# EAGLE design MM2017-18_uC_Main (EAGLE 8.5.0)
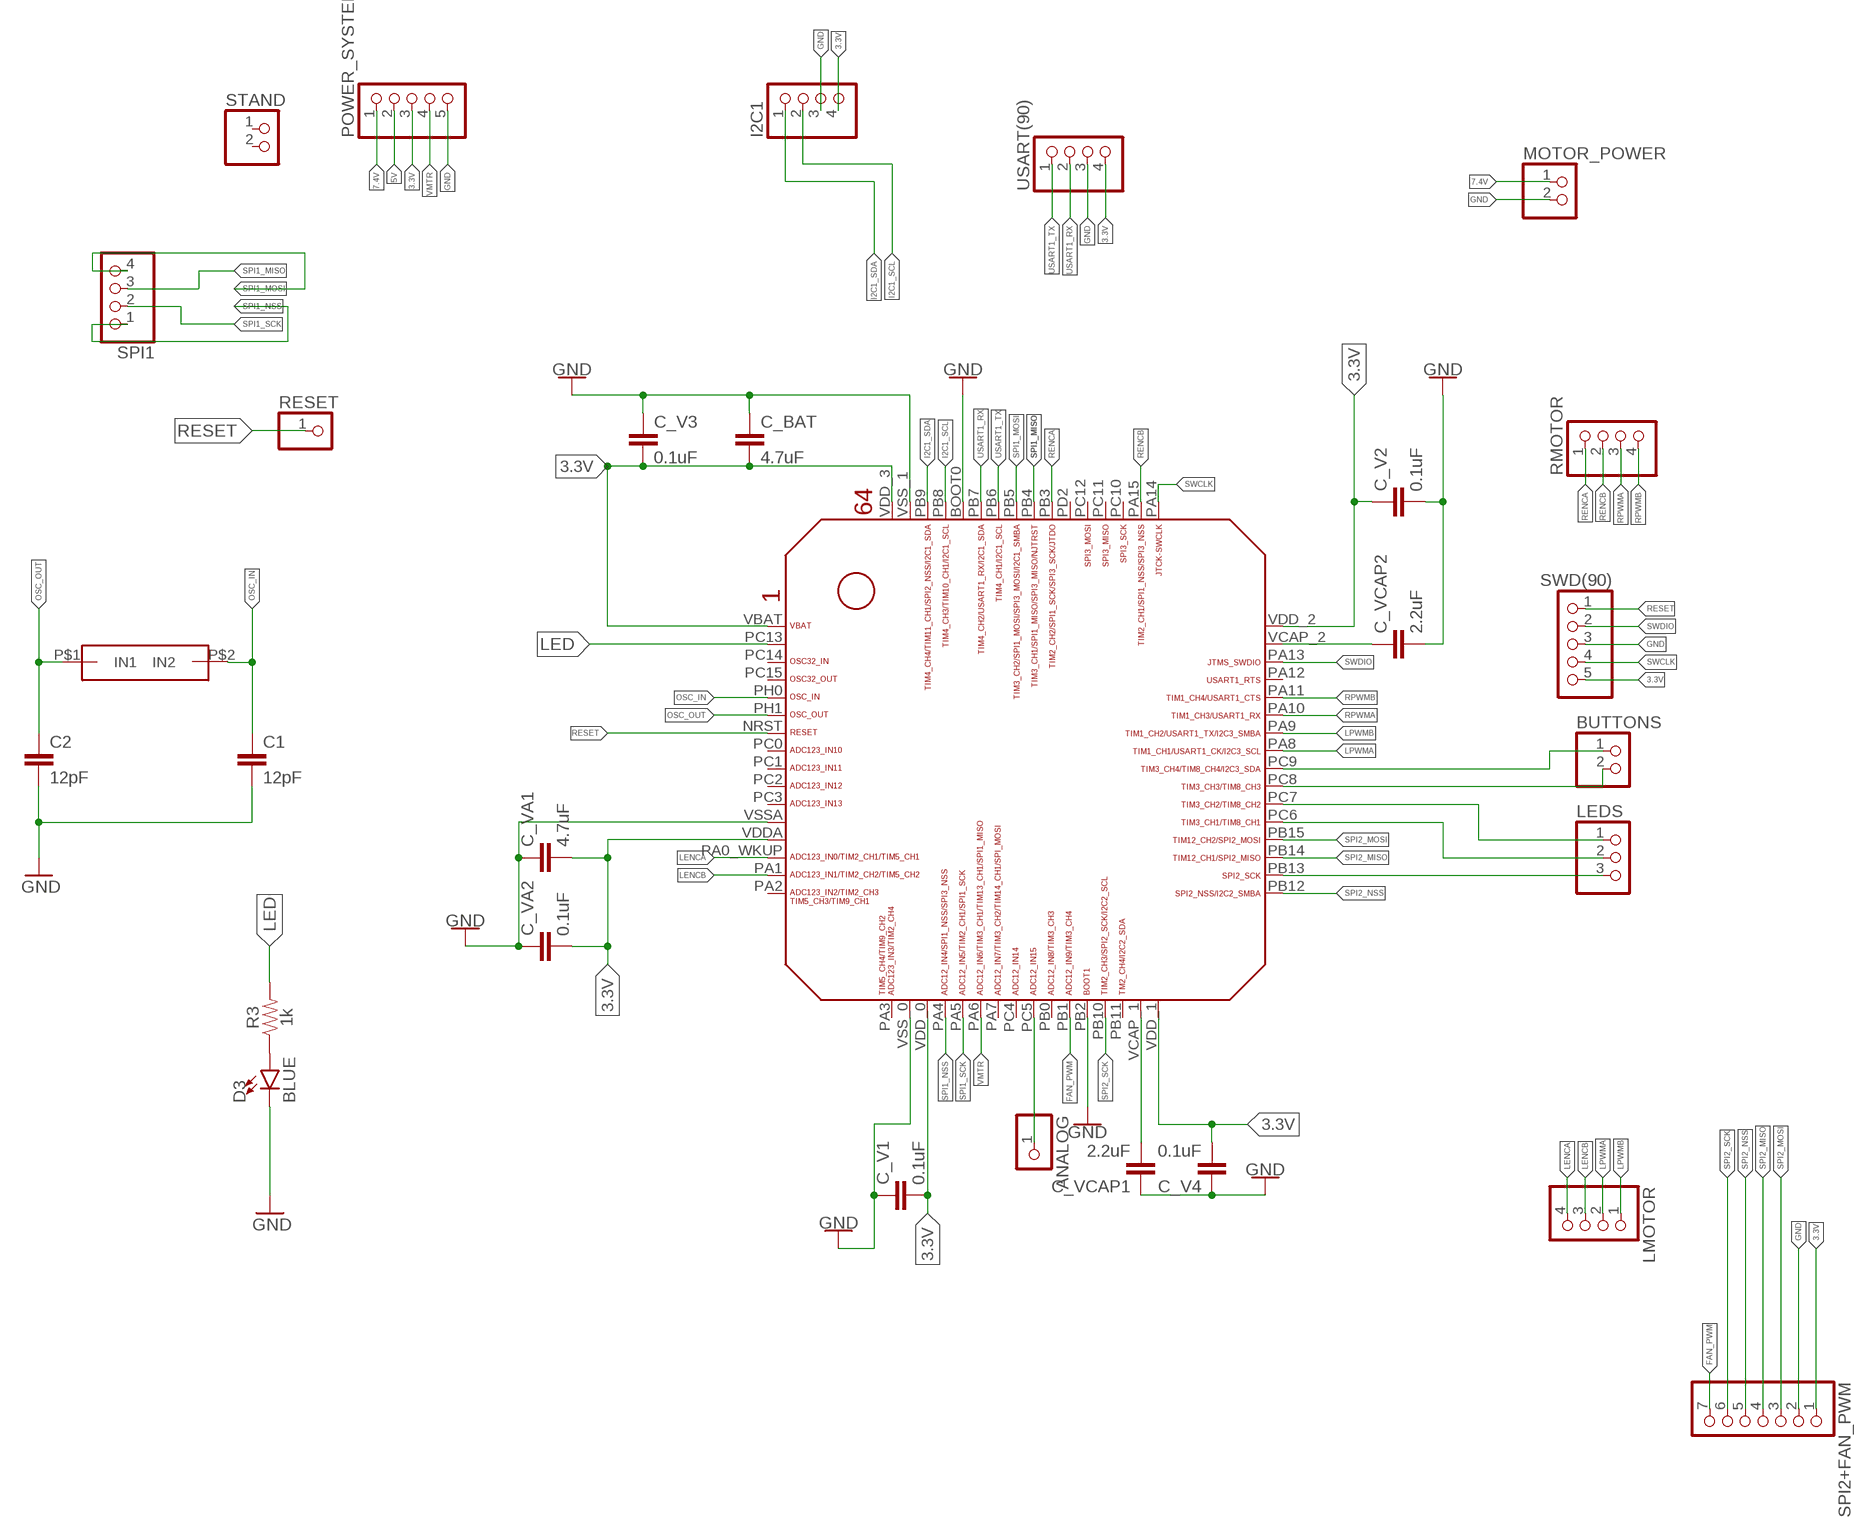
[diagram p0: schematic, sheet 1]

## Parts
ANALOG  PINHD-1X1  [1X01]
BUTTONS  PINHD-1X2  [1X02]
C1  12pF  22PF-0603-50V-5%  [0603]
C2  12pF  22PF-0603-50V-5%  [0603]
C_BAT  4.7uF  22UF-0805-6.3V-20%  [0805]
C_V1  0.1uF  22UF-0805-6.3V-20%  [0805]
C_V2  0.1uF  22UF-0805-6.3V-20%  [0805]
C_V3  0.1uF  22UF-0805-6.3V-20%  [0805]
C_V4  0.1uF  22UF-0805-6.3V-20%  [0805]
C_VA1  4.7uF  22UF-0805-6.3V-20%  [0805]
C_VA2  0.1uF  22UF-0805-6.3V-20%  [0805]
C_VCAP1  2.2uF  22UF-0805-6.3V-20%  [0805]
C_VCAP2  2.2uF  22UF-0805-6.3V-20%  [0805]
D3  BLUE  LED-BLUE1206  [LED-1206]
I2C1  PINHD-1X4  [1X04]
LEDS  PINHD-1X3  [1X03]
LMOTOR  PINHD-1X4  [1X04]
MOTOR_POWER  PINHD-1X2  [1X02]
POWER_SYSTEM  PINHD-1X5  [1X05]
R3  1k  0.75OHM-0805-1/4W-1%  [0805]
RESET  PINHD-1X1  [1X01]
RMOTOR  PINHD-1X4  [1X04]
SPI1  PINHD-1X4  [1X04]
SPI2+FAN_PWM  PINHD-1X7  [1X07]
STAND  PINHD-1X2  [1X02]
SWD(90)  PINHD-1X5  [1X05]
U$1  STM32F405/415_LQFP64  [STM32F405/415_LQFP64]
U$2  OSC  [OSC]
USART(90)  PINHD-1X4  [1X04]

## Nets
3.3V: C_BAT.2 C_V1.2 C_V2.1 C_V3.2 C_V4.2 C_VA1.2 C_VA2.2 I2C1.4 POWER_SYSTEM.3 SPI2+FAN_PWM.1 SWD(90).5 U$1.VBAT U$1.VDD_0 U$1.VDD_1 U$1.VDD_2 U$1.VDD_3 U$1.VDDA USART(90).4
5V: POWER_SYSTEM.2
7.4V: MOTOR_POWER.1 POWER_SYSTEM.1
EXTRA_ANALOG: ANALOG.1 U$1.PC5
FAN_PWM: SPI2+FAN_PWM.7 U$1.PB1
GND: C1.2 C2.2 C_BAT.1 C_V1.1 C_V2.2 C_V3.1 C_V4.1 C_VA1.1 C_VA2.1 C_VCAP1.1 C_VCAP2.2 D3.C I2C1.3 MOTOR_POWER.2 POWER_SYSTEM.5 SPI2+FAN_PWM.2 SWD(90).3 U$1.BOOT0 U$1.PB2 U$1.VSS_0 U$1.VSS_1 U$1.VSSA USART(90).3
GPIO1: BUTTONS.1 U$1.PC9
GPIO2: BUTTONS.2 U$1.PC8
GPIO3: LEDS.1 U$1.PC7
GPIO4: LEDS.2 U$1.PC6
GPIO5: LEDS.3 U$1.PB13
I2C1_SCL: I2C1.2 U$1.PB8
I2C1_SDA: I2C1.1 U$1.PB9
LED: R3.2 U$1.PC13
LENCA: LMOTOR.4 U$1.PA0_WKUP(PA0_AKUP)
LENCB: LMOTOR.3 U$1.PA1
LPWMA: LMOTOR.2 U$1.PA8
LPWMB: LMOTOR.1 U$1.PA9
N$3: D3.A R3.1
OSC_IN: C1.1 U$1.PH0 U$2.P$2(IN2)
OSC_OUT: C2.1 U$1.PH1 U$2.P$1(IN1)
RENCA: RMOTOR.1 U$1.PB3
RENCB: RMOTOR.2 U$1.PA15
RESET: RESET.1 SWD(90).1 U$1.NRST
RPWMA: RMOTOR.3 U$1.PA10
RPWMB: RMOTOR.4 U$1.PA11
SPI1_MISO: SPI1.3 U$1.PB4
SPI1_MOSI: SPI1.4 U$1.PB5
SPI1_NSS: SPI1.1 U$1.PA4
SPI1_SCK: SPI1.2 U$1.PA5
SPI2_MISO: SPI2+FAN_PWM.4 U$1.PB14
SPI2_MOSI: SPI2+FAN_PWM.3 U$1.PB15
SPI2_NSS: SPI2+FAN_PWM.5 U$1.PB12
SPI2_SCK: SPI2+FAN_PWM.6 U$1.PB10
SWCLK: SWD(90).4 U$1.PA14
SWDIO: SWD(90).2 U$1.PA13
USART1_RX: U$1.PB7 USART(90).2
USART1_TX: U$1.PB6 USART(90).1
VCAP_1: C_VCAP1.2 U$1.VCAP_1
VCAP_2: C_VCAP2.1 U$1.VCAP_2
VMTR: POWER_SYSTEM.4 U$1.PA6
Unconnected: STAND.1 STAND.2 U$1.PA2 U$1.PA3 U$1.PA7 U$1.PA12 U$1.PB0 U$1.PB11 U$1.PC0 U$1.PC1 U$1.PC2 U$1.PC3 U$1.PC4 U$1.PC10 U$1.PC11 U$1.PC12 U$1.PC14 U$1.PC15 U$1.PD2

## Library data of the parts
ANALOG RESET = pinhead:PINHD-1X1: PIN HEADER
BUTTONS MOTOR_POWER STAND = pinhead:PINHD-1X2: PIN HEADER
C1 C2 = SparkFun-Capacitors:22PF: 22pF ceramic capacitors A capacitor is a passive two-terminal electrical component used to store electrical energy temporarily in an electric field.; PROD_ID: CAP-07876; VALUE: 22pF
C_BAT C_V1-C_V4 C_VA1 C_VA2 C_VCAP1 C_VCAP2 = SparkFun-Capacitors:22UF: 22µF ceramic capacitors A capacitor is a passive two-terminal electrical component used to store electrical energy temporarily in an electric field.; PROD_ID: CAP-08402; VALUE: 22uF
D3 = SparkFun-LED:LED-BLUE: Blue SMD LED Used in manufacturing of various products at SparkFun Packages: 0603 - SMD 0603 package [Product Link] <http://www.digikey.com/product-detail/en/SMLE12BC7TT86/511-1589-2-ND/1641808> 1206 - SMD1206 package [Product Link] <http://www.digikey.com/product-detail/en/lite-on-inc/LTST-C150TBKT/160-1643-1-ND/573584> SparkFun Products: ESP8266 Thing-Dev Board <https://www.sparkfun.com/products/13711> RedBoard <https://www.sparkfun.com/products/12757>; PROD_ID: DIO-09911
I2C1 LMOTOR RMOTOR SPI1 USART(90) = pinhead:PINHD-1X4: PIN HEADER
LEDS = pinhead:PINHD-1X3: PIN HEADER
POWER_SYSTEM SWD(90) = pinhead:PINHD-1X5: PIN HEADER
R3 = SparkFun-Resistors:0.75OHM: 0.75Ω resistor A resistor is a passive two-terminal electrical component that implements electrical resistance as a circuit element. Resistors act to reduce current flow, and, at the same time, act to lower voltage levels within circuits. - Wikipedia; PROD_ID: RES-08474; VALUE: 0.75
SPI2+FAN_PWM = pinhead:PINHD-1X7: PIN HEADER
U$1 = STM32F405RG:STM32F405/415_LQFP64
U$2 = Cristal Oscillator:OSC

## Board
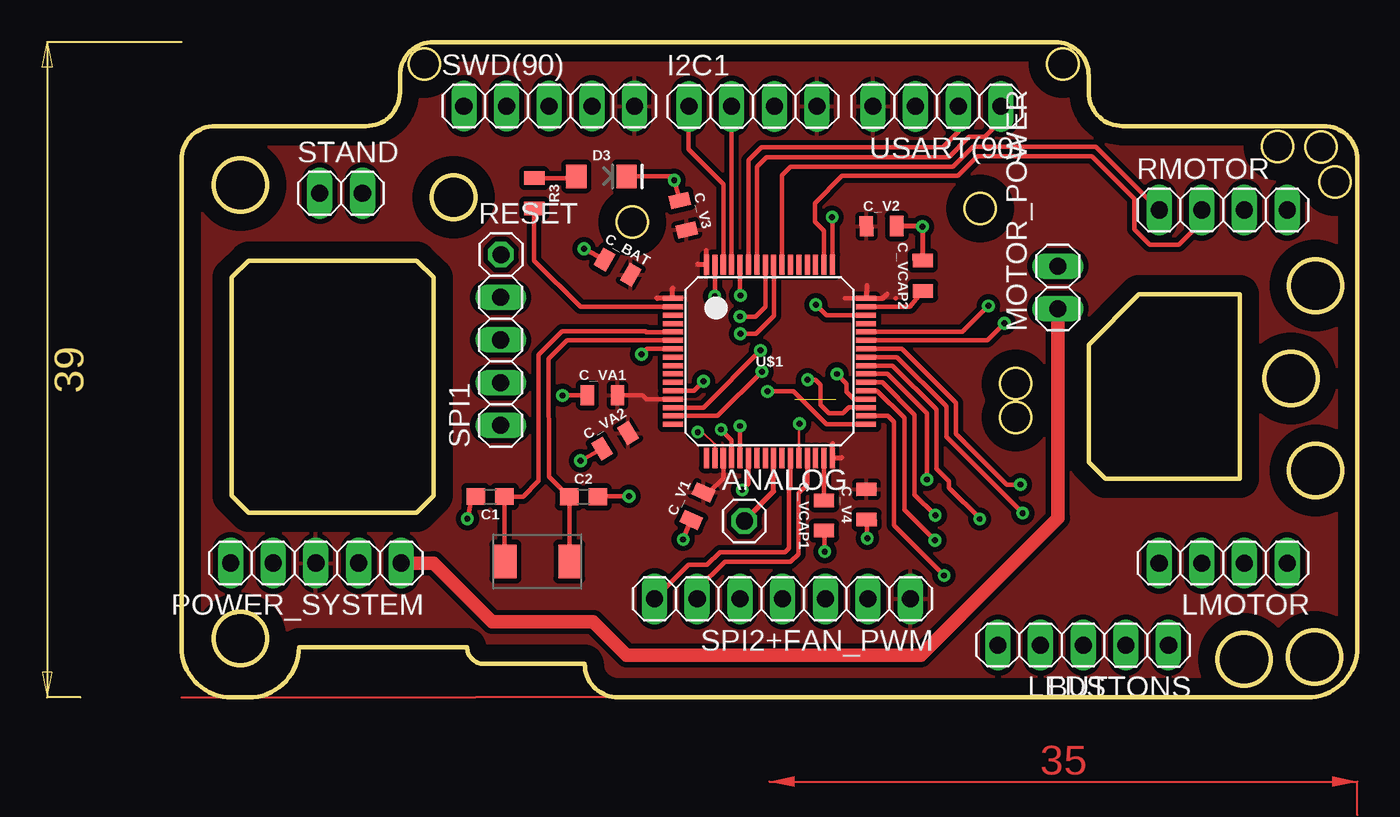
[diagram p1: board, top side]
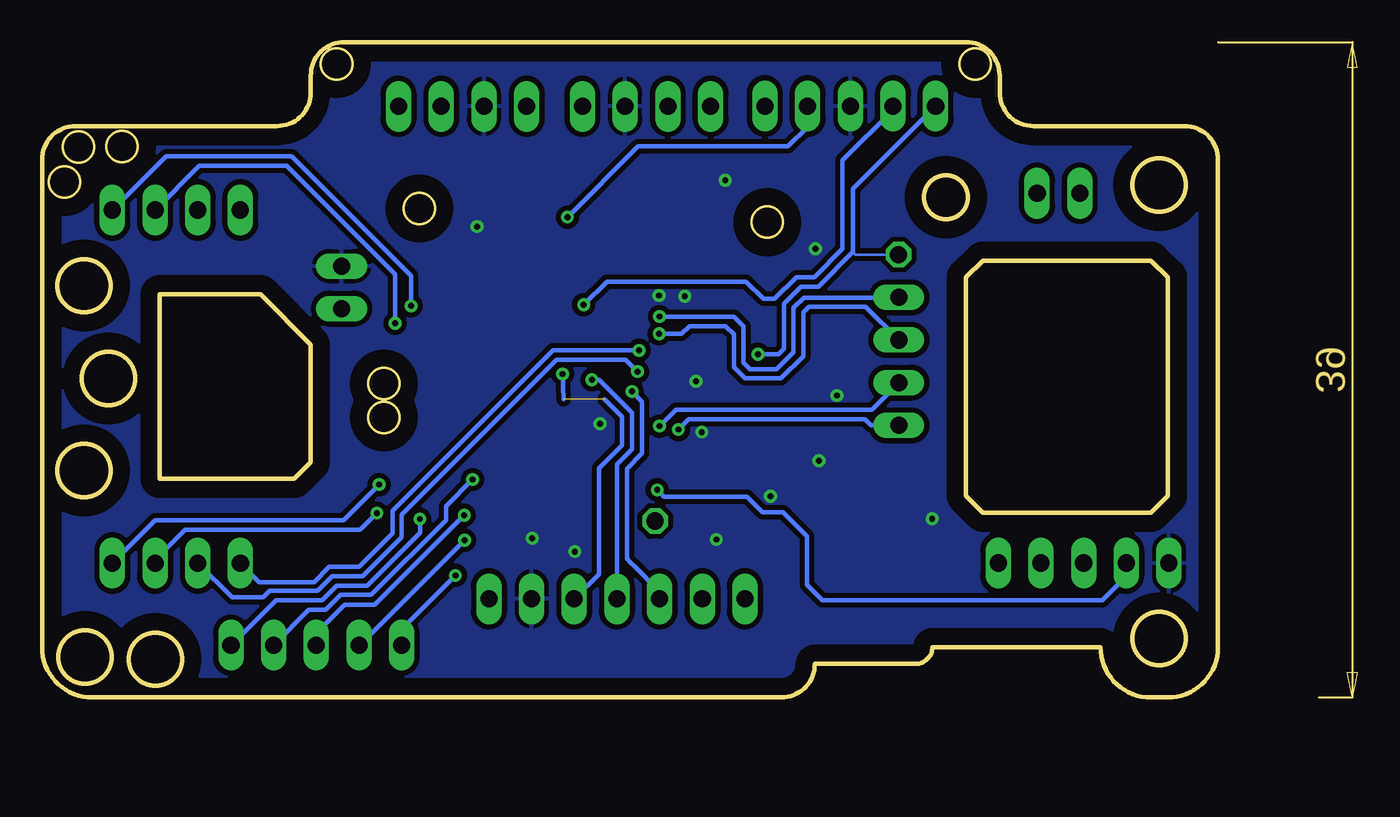
[diagram p2: board, bottom side, seen from below]

Size 70 x 39 mm. Coordinates in mm from the lower left corner, seen from the top.
Outline: 67,0 arc90 70,3 70,32 arc90 68,34 56,34 arc-90 54,36 54,37 arc90 52,39 15,39 arc90 13,37 13,36 arc-90 11,34 2,34 arc90 0,32 0,3 arc90 3,0 4,0 arc90 7,3 17,3 arc90 18,2 24,2 arc90 26,0 67,0
Outline: 3,12 4,11 14,11 15,12 15,25 14,26 4,26 3,25 3,12
Outline: 63,13 55,13 54,14 54,21 57,24 63,24 63,13
Outline: circle at 3.5,3.5 radius 1.58
Outline: circle at 3.5,30.5 radius 1.58
Outline: circle at 67.5,24.5 radius 1.58
Outline: circle at 67.5,13.5 radius 1.58
Outline: circle at 66.05,18.98 radius 1.58
Outline: circle at 63.25,2.28 radius 1.58
Outline: circle at 67.45,2.41 radius 1.58
Outline: circle at 14.46,37.69 radius 0.92
Outline: circle at 65.25,32.79 radius 0.92
Outline: circle at 67.83,32.75 radius 0.92
Outline: circle at 68.65,30.67 radius 0.92
Outline: circle at 52.46,37.69 radius 0.92
Outline: circle at 26.84,28.28 radius 0.92
Outline: circle at 49.65,18.67 radius 0.92
Outline: circle at 49.65,16.67 radius 0.92
Outline: circle at 16.2,29.77 radius 1.3
Outline: circle at 47.53,29.09 radius 0.92
Copper layers (1*16): Top 0.035mm / dielectric 1.5mm / Bottom 0.035mm
Design rules "default": minimum track width 6mil, minimum drill 0.35mm, track to track 6mil, track to pad 6mil, pad to pad 6mil, via to via 6mil, smd to smd 6mil, copper to edge 40mil, drill to drill 6mil, minimum pad ring 10mil, minimum via ring 8mil, stop-mask expansion 4mil, vias tented up to drill 0mil, thermal gap 10mil

### Footprints (pad centres in the part's own frame; a part is rotated, then mirrored left to right if it is on the bottom)
1X01 = drill 1.016 octagon: 1 0,0
1X02 = drill 1.016 long: 1 -1.27,0; 2 1.27,0
0603 = smd 1.1 x 1: 1 -0.85,0; 2 0.85,0
0805 = smd 0.8 x 1.2: 1 -0.9,0; 2 0.9,0
LED-1206 = smd 1.2 x 1.4: A -1.5,0; C 1.5,0
1X04 = drill 1.016 long: 1 -3.81,0; 2 -1.27,0; 3 1.27,0; 4 3.81,0
1X03 = drill 1.016 long: 1 -2.54,0; 2 0,0; 3 2.54,0
1X05 = drill 1.016 long: 1 -5.08,0; 2 -2.54,0; 3 0,0; 4 2.54,0; 5 5.08,0
1X07 = drill 1.016 long: 1 -7.62,0; 2 -5.08,0; 3 -2.54,0; 4 0,0; 5 2.54,0; 6 5.08,0; 7 7.62,0
STM32F405/415_LQFP64 = smd 0.3 x 1.2: BOOT0 -1.75,5.75; PA3 -3.75,-5.75; PA4 -2.25,-5.75; PA5 -1.75,-5.75; PA6 -1.25,-5.75; PA7 -0.75,-5.75; PA14 3.75,5.75; PA15 3.25,5.75; PB0 0.75,-5.75; PB1 1.25,-5.75; PB2 1.75,-5.75; PB3 0.75,5.75; PB4 0.25,5.75; PB5 -0.25,5.75; PB6 -0.75,5.75; PB7 -1.25,5.75; PB8 -2.25,5.75; PB9 -2.75,5.75; PB10 2.25,-5.75; PB11 2.75,-5.75; PC4 -0.25,-5.75; PC5 0.25,-5.75; PC10 2.75,5.75; PC11 2.25,5.75; PC12 1.75,5.75; PD2 1.25,5.75; VCAP_1 3.25,-5.75; VDD_0 -2.75,-5.75; VDD_1 3.75,-5.75; VDD_3 -3.75,5.75; VSS_0 -3.25,-5.75; VSS_1 -3.25,5.75 | smd 1.2 x 0.3: NRST -5.75,0.75; PA0_WKUP -5.75,-2.75; PA1 -5.75,-3.25; PA2 -5.75,-3.75; PA8 5.75,0.25; PA9 5.75,0.75; PA10 5.75,1.25; PA11 5.75,1.75; PA12 5.75,2.25; PA13 5.75,2.75; PB12 5.75,-3.75; PB13 5.75,-3.25; PB14 5.75,-2.75; PB15 5.75,-2.25; PC0 -5.75,0.25; PC1 -5.75,-0.25; PC2 -5.75,-0.75; PC3 -5.75,-1.25; PC6 5.75,-1.75; PC7 5.75,-1.25; PC8 5.75,-0.75; PC9 5.75,-0.25; PC13 -5.75,3.25; PC14 -5.75,2.75; PC15 -5.75,2.25; PH0 -5.75,1.75; PH1 -5.75,1.25; VBAT -5.75,3.75; VCAP_2 5.75,3.25; VDD_2 5.75,3.75; VDDA -5.75,-2.25; VSSA -5.75,-1.75
OSC = smd 1.3 x 2: P$1 0,0.1; P$2 3.8,0.1

### Placement (x,y rotation side)
ANALOG  33.5,10.5 0 top
BUTTONS  57.48,3.11 180 top
C1  18.37,11.95 180 top
C2  23.92,11.94 0 top
C_BAT  25.96,25.6 329.9 top
C_V1  30.71,11.38 65.9 top
C_V2  41.67,28.05 0.5 top
C_V3  29.87,28.7 283.2 top
C_V4  40.78,11.49 90.3 top
C_VA1  25.06,17.99 0 top
C_VA2  25.8,15.27 31 top
C_VCAP1  38.24,10.83 90.1 top
C_VCAP2  44.13,25.09 90.3 top
D3  25,31 0 top
I2C1  34.02,35.17 0 top
LEDS  51.14,3.12 180 top
LMOTOR  62,8 180 top
MOTOR_POWER  52.17,24.4 90 top
POWER_SYSTEM  8,8 180 top
R3  21,30 270 top
RESET  19.02,26.35 0 top
RMOTOR  62,29 0 top
SPI1  19,20 90 top
SPI2+FAN_PWM  35.78,5.87 180 top
STAND  9.5,30 0 top
SWD(90)  21.89,35.19 0 top
U$1  35,20 0 top
U$2  23.09,8.19 180 top
USART(90)  44.97,35.17 180 top

### Tracks (layer width: path | path; a pad name or v marks a point on that pad's centre or on a via)
3.3V
  Top 0.254: C_VA1.2 27.44,17.99 27.67,17.76 U$1.VDDA | U$1.VDD_0 32.25,13.04 31.41,12.21 C_V1.2 | 40.81,24.17 40.81,24.51 | 42.51,23.75 42.52,23.74 | U$1.VDD_2 39.49,23.75
  Top 0.305: 39.3,14.27 U$1.VDD_1 38.75,15.12 | 31.24,26.6 31.25,26.59 U$1.VDD_3 30.76,25.75 30.73,25.78 | 29.24,24.35 U$1.VBAT 28.33,23.75 28.3,23.78 | 40.81,24.17 40.81,23.81 U$1.VDD_2 41.75,23.75 42,24
  pour Top (isolate 0.305): -8.3,56.69 -8.3,-10.51 -6.07,-12.74 76.94,-12.74 82.39,-7.29 82.39,52.64 77.92,57.11 -7.97,57.11 -8.34,56.74 -8.27,56.74 -8.23,56.7
7.4V
  Top 0.813: POWER_SYSTEM.1 15,8 18.5,4.5 24.5,4.5 26.5,2.5 44,2.5 52.17,10.67 MOTOR_POWER.1
EXTRA_ANALOG
  Top 0.305: U$1.PC5 35.25,12.26 ANALOG.1
FAN_PWM
  Top 0.254: U$1.PB1 36.25,12.45 36.15,12.36 36.15,8.88 35.92,8.65 32.04,8.65 31.29,7.9 30.19,7.9 SPI2+FAN_PWM.7
GND  (via drill 0.35)
  Top 0.152: U$1.PB2 36.75,16.25 v36.79,16.29 | v31.75,23.88 v31.74,23.87 | 33.25,23.94 v33.27,23.92 | 24.72,11.99 C2.2 | U$1.VSS_0 31.75,15.06 31.02,15.79 v30.73,15.79 | C_VCAP2.2
  Top 0.254: U$1.VSS_1 v31.75,23.88 | U$1.BOOT0 33.25,23.94 | U$1.VSSA 30.51,18.25 v31.07,18.81 | C_V3.1 v29.33,30.78 29.11,31 D3.C | v23.96,26.7 C_BAT.1 | C_VCAP1.1 v38.29,8.68 | C_V4.1 v40.82,9.47 | v26.64,11.97 24.72,11.99 | v29.86,9.4 C_V1.1 | v23.75,14.09 C_VA2.1 | v22.68,17.97 C_VA1.1 | v17.02,10.63 17.32,12.15 C1.2
  Top 0.305: C_V2.2 44.06,28.05 v44.1,28.02 44.12,27.99 C_VCAP2.2
  pour Bottom (isolate 0.305): -6.66,55.54 -6.66,-7.75 -3.63,-10.78 75.91,-10.78 79.82,-6.87 79.82,52.11 76.79,55.14 -6.4,55.14
GPIO1  (via drill 0.35)
  Top 0.254: U$1.PC9 42.32,19.75 44.93,17.14 44.93,13.61 45.68,12.86 45.68,12.49 47.51,10.66 v47.51,10.62
  Bottom 0.254: v47.51,10.62 47.51,9.81 50.66,6.66 52.47,6.66 53.33,5.8 56.07,5.8 BUTTONS.1
GPIO2  (via drill 0.35)
  Top 0.254: U$1.PC8 42.02,19.25 44.37,16.9 v44.37,12.97
  Bottom 0.254: v44.37,12.97 45.95,11.39 45.95,10.55 50.4,6.1 52.22,6.1 53.11,5.21 54.12,5.21 BUTTONS.2
GPIO3  (via drill 0.35)
  Top 0.254: U$1.PC7 41.72,18.75 43.64,16.83 43.64,12.07 v44.87,10.84
  Bottom 0.254: v44.87,10.84 50.2,5.51 52,5.51 53.68,3.83 LEDS.1
GPIO4  (via drill 0.35)
  Top 0.254: U$1.PC6 41.41,18.25 43.03,16.63 43.03,11.17 v44.85,9.35
  Bottom 0.254: v44.85,9.35 51.08,3.12 LEDS.2
GPIO5  (via drill 0.35)
  Top 0.254: U$1.PB13 42.06,16.75 42.41,16.4 42.41,10.24 v45.39,7.26
  Bottom 0.254: LEDS.3 48.6,4.05 v45.39,7.26
I2C1_SCL
  Top 0.254: U$1.PB8 I2C1.2 | I2C1.2
I2C1_SDA
  Top 0.254: U$1.PB9 32.25,30.55 30.18,32.62 30.18,35.14 I2C1.1
LED
  Top 0.254: U$1.PC13 23.75,23.25 21,26 R3.2
LENCA  (via drill 0.35)
  Top 0.254: U$1.PA0_WKUP 31.07,17.25 v34.47,20.65
  Bottom 0.254: v34.47,20.65 39.59,20.65 49.14,11.1 49.14,9.76 51.13,7.77 52.91,7.77 53.81,6.87 57.06,6.87 LMOTOR.4
LENCB  (via drill 0.35)
  Top 0.254: U$1.PA1 31.91,16.75 v34.55,19.39
  Bottom 0.254: v34.55,19.39 35.26,20.1 39.36,20.1 48.59,10.87 48.59,9.53 50.91,7.21 52.72,7.21 53.58,6.35 56.44,6.35 56.83,5.96 58.69,5.96 LMOTOR.3
LPWMA  (via drill 0.35)
  Top 0.254: U$1.PA8 42.6,20.25 45.53,17.32 45.53,15.51 v50.07,10.97
  Bottom 0.254: v50.07,10.97 51.06,9.98 61.49,9.98 63.27,8.2 LMOTOR.2
LPWMB  (via drill 0.35)
  Top 0.254: U$1.PA9 42.89,20.75 46.1,17.54 46.1,15.69 49.12,12.67 v49.93,12.67
  Bottom 0.254: v49.93,12.67 52.06,10.54 63.27,10.54 LMOTOR.1
N$3
  Top 0.254: R3.1 23.4,30.9 D3.A
OSC_IN
  Top 0.152: 19.29,11.89 C1.1
  Top 0.254: U$2.P$2 19.22,8.16 C1.1 20.34,11.95 21.27,12.88 21.25,20.4 22.64,21.79 27.61,21.79 27.66,21.74 U$1.PH0
OSC_OUT
  Top 0.254: U$2.P$1 23.09,11.92 C2.1 21.88,13.13 21.86,20.15 22.96,21.25 U$1.PH1
RENCA
  Top 0.254: U$1.PB3 35.75,31.08 36.25,31.58 45.93,31.58 47.11,32.76 54.44,32.76 RMOTOR.1
RENCB
  Top 0.254: U$1.PA15 38.25,27.78 37.71,28.32 37.71,29.42 39.32,31.03 46.21,31.03 47.37,32.19 54.19,32.19 56.71,29.67 56.71,27.87 57.63,26.95 59.38,26.95 60.74,28.31 60.73,28.32 RMOTOR.2
RESET  (via drill 0.35)
  Top 0.254: U$1.NRST 27.71,20.75 v27.38,20.42
  Bottom 0.152: RESET.1 21.57,26.35 21.73,26.51
  Bottom 0.254: v27.38,20.42 26.16,20.42 25.84,20.74 25.84,23.43 24.82,24.45 23.79,24.45 21.73,26.51 21.73,30.27 SWD(90).1
RPWMA  (via drill 0.35)
  Top 0.254: U$1.PA10 47.96,21.25 v48.98,22.27
  Bottom 0.254: RMOTOR.3 60.64,31.64 55.43,31.64 48.98,25.19 v48.98,22.27
RPWMB  (via drill 0.35)
  Top 0.254: U$1.PA11 46.48,21.75 v48.03,23.3
  Bottom 0.254: RMOTOR.4 62.62,32.2 55.13,32.2 48.03,25.1 v48.03,23.3
SPI1_MISO  (via drill 0.35)
  Top 0.254: v33.27,21.64 34.2,21.64 35.26,22.7 U$1.PB4
  Bottom 0.152: SPI1.3
  Bottom 0.254: v33.27,21.64 31.93,21.64 31.47,22.1 29.32,22.1 28.81,21.6 28.81,19.65 28.16,18.99 26,18.99 24.68,20.32 24.68,22.94 24.36,23.25 20.98,23.25 SPI1.3
SPI1_MOSI  (via drill 0.35)
  Top 0.152: 33.26,22.65 v33.25,22.66
  Top 0.254: U$1.PB5 34.75,23.24 34.16,22.65 33.26,22.65
  Bottom 0.152: 19.02,23.79 SPI1.4
  Bottom 0.254: v33.25,22.66 28.83,22.66 28.26,22.1 28.26,19.92 27.87,19.53 26.27,19.53 25.28,20.53 25.28,23.18 24.66,23.8 19.02,23.8 19.02,23.79
SPI1_NSS  (via drill 0.35)
  Top 0.254: U$1.PA4 32.75,15.31 v32.12,15.94
  Bottom 0.152: 19.02,16.17 SPI1.1
  Bottom 0.254: v32.12,15.94 31.51,16.55 26.12,16.55 21.01,16.55 20.65,16.19 19.03,16.19 19.02,16.17
SPI1_SCK  (via drill 0.35)
  Top 0.254: U$1.PA5 v33.25,16.15
  Bottom 0.254: v33.25,16.15 32.27,17.13 20.6,17.13 SPI1.2
SPI2_MISO  (via drill 0.35)
  Top 0.254: v37.27,18.9 37.73,18.9 38.02,18.61 38.02,17.43 38.53,16.92 39.38,16.92 39.73,17.27 40.73,17.27 U$1.PB14
  Bottom 0.254: v37.27,18.9 36.85,18.9 34.88,16.93 34.88,14.77 35.76,13.89 35.76,5.89 SPI2+FAN_PWM.4
SPI2_MOSI  (via drill 0.35)  (1 unrouted)
  Top 0.254: 40.74,17.74 U$1.PB15 40.02,17.75 39.59,18.18 39.59,18.68 v39.02,19.25
  Bottom 0.254: 36.52,17.73 35.48,16.69 35.48,15 36.85,13.63 36.85,7.34 SPI2+FAN_PWM.3 | 38.95,17.73 v39.02,19.25
SPI2_NSS  (via drill 0.35)
  Top 0.254: v34.88,18.21 36.43,18.21 38.39,16.25 U$1.PB12
  Bottom 0.254: v34.88,18.21 34.28,17.61 34.28,14.53 35.19,13.62 35.19,8.25 34.97,8.03 34.77,7.83 33.24,6.3 SPI2+FAN_PWM.5
SPI2_SCK
  Top 0.254: U$1.PB10 37.25,12.67 36.72,12.14 36.72,8.53 36.26,8.07 32.34,8.07 30.7,6.43 SPI2+FAN_PWM.6
SWCLK  (via drill 0.35)
  Top 0.254: U$1.PA14 38.75,28.56 v38.73,28.58
  Bottom 0.254: v38.73,28.58 34.52,32.79 25.59,32.79 24.44,33.94 SWD(90).4
SWDIO  (via drill 0.35)
  Top 0.254: U$1.PA13 38.38,22.75 v37.76,23.37
  Bottom 0.254: v37.76,23.37 36.38,24.75 28.09,24.75 27.05,23.71 26.39,23.71 25.09,25.01 24.03,25.01 22.35,26.69 22.35,31.96 19.37,34.94 19.37,35.17 SWD(90).2
USART1_RX
  Top 0.254: U$1.PB7 33.75,31.96 34.52,32.73 45.32,32.73 46.27,33.68 46.27,35.14 USART(90).2
USART1_TX
  Top 0.254: U$1.PB6 34.25,31.59 34.81,32.15 45.67,32.15 46.87,33.35 47.82,33.35 48.82,34.35 48.82,35.13 USART(90).1
VCAP_1
  Top 0.254: U$1.VCAP_1 C_VCAP1.2 | C_VCAP1.2 | C_VCAP1.2
VCAP_2
  Top 0.254: U$1.VCAP_2 43.35,23.24 C_VCAP2.1
VMTR  (via drill 0.35)
  Top 0.254: v33.38,12.35 33.75,12.72 U$1.PA6
  Bottom 0.254: POWER_SYSTEM.4 5.46,7.2 6.88,5.78 23.54,5.78 24.47,6.71 24.47,9.59 25.9,11.02 27.11,11.02 28.03,11.94 32.97,11.94 v33.38,12.35
(copper drawn outside any net)
  shapes: Top area x2